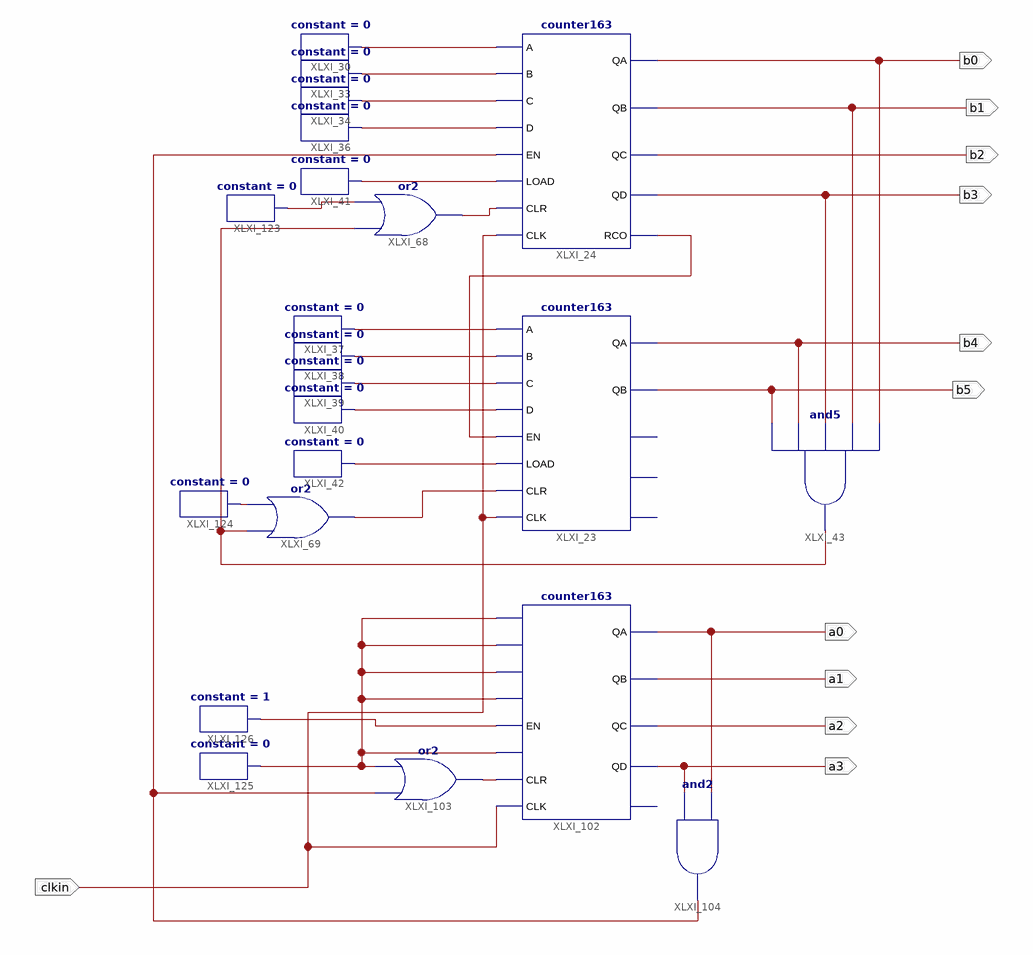
[diagram p0: schematic sheet 1]
// Xilinx ISE schematic test.sch (spartan3e) as structural Verilog: 22 symbols, 11 ports
module test (
  input  clkin,
  output b0,
  output b1,
  output b3,
  output b4,
  output b5,
  output b2,
  output a3,
  output a0,
  output a2,
  output a1
);

  wire XLXN_66, XLXN_106, XLXN_151, XLXN_178, XLXN_179, XLXN_180, XLXN_181, XLXN_182, XLXN_184, XLXN_197,
       XLXN_198, XLXN_199, XLXN_200, XLXN_201, XLXN_202, XLXN_203, XLXN_205, XLXN_212, XLXN_213, XLXN_214;

  or XLXI_103 (XLXN_151, XLXN_214, XLXN_212);
  and XLXI_104 (XLXN_214, a3, a0);
  counter163 XLXI_102 (
    .A(XLXN_212), .B(XLXN_212), .C(XLXN_212), .D(XLXN_212), .EN(XLXN_205), .LOAD(XLXN_212), .CLR(XLXN_151),
    .CLK(clkin), .QA(a0), .QD(a3), .QB(a1), .QC(a2));  // open: RCO
  counter163 XLXI_23 (
    .A(XLXN_197), .B(XLXN_198), .C(XLXN_199), .D(XLXN_200), .EN(XLXN_213), .LOAD(XLXN_201), .CLR(XLXN_106),
    .CLK(clkin), .QA(b4), .QB(b5));  // open: RCO, QD, QC
  counter163 XLXI_24 (
    .A(XLXN_178), .B(XLXN_179), .C(XLXN_180), .D(XLXN_181), .EN(XLXN_214), .LOAD(XLXN_182), .CLR(XLXN_66),
    .CLK(clkin), .RCO(XLXN_213), .QA(b0), .QD(b3), .QB(b1), .QC(b2));
  or XLXI_68 (XLXN_66, XLXN_184, XLXN_202);
  or XLXI_69 (XLXN_106, XLXN_184, XLXN_203);
  and XLXI_43 (XLXN_184, b5, b4, b3, b1, b0);
  constant #(.CValue("0")) XLXI_33 (.O(XLXN_179));
  constant #(.CValue("0")) XLXI_30 (.O(XLXN_178));
  constant #(.CValue("0")) XLXI_36 (.O(XLXN_181));
  constant #(.CValue("0")) XLXI_34 (.O(XLXN_180));
  constant #(.CValue("0")) XLXI_41 (.O(XLXN_182));
  constant #(.CValue("0")) XLXI_37 (.O(XLXN_197));
  constant #(.CValue("0")) XLXI_38 (.O(XLXN_198));
  constant #(.CValue("0")) XLXI_39 (.O(XLXN_199));
  constant #(.CValue("0")) XLXI_40 (.O(XLXN_200));
  constant #(.CValue("0")) XLXI_42 (.O(XLXN_201));
  constant #(.CValue("0")) XLXI_123 (.O(XLXN_202));
  constant #(.CValue("0")) XLXI_124 (.O(XLXN_203));
  constant #(.CValue("0")) XLXI_125 (.O(XLXN_212));
  constant #(.CValue("1")) XLXI_126 (.O(XLXN_205));
endmodule
